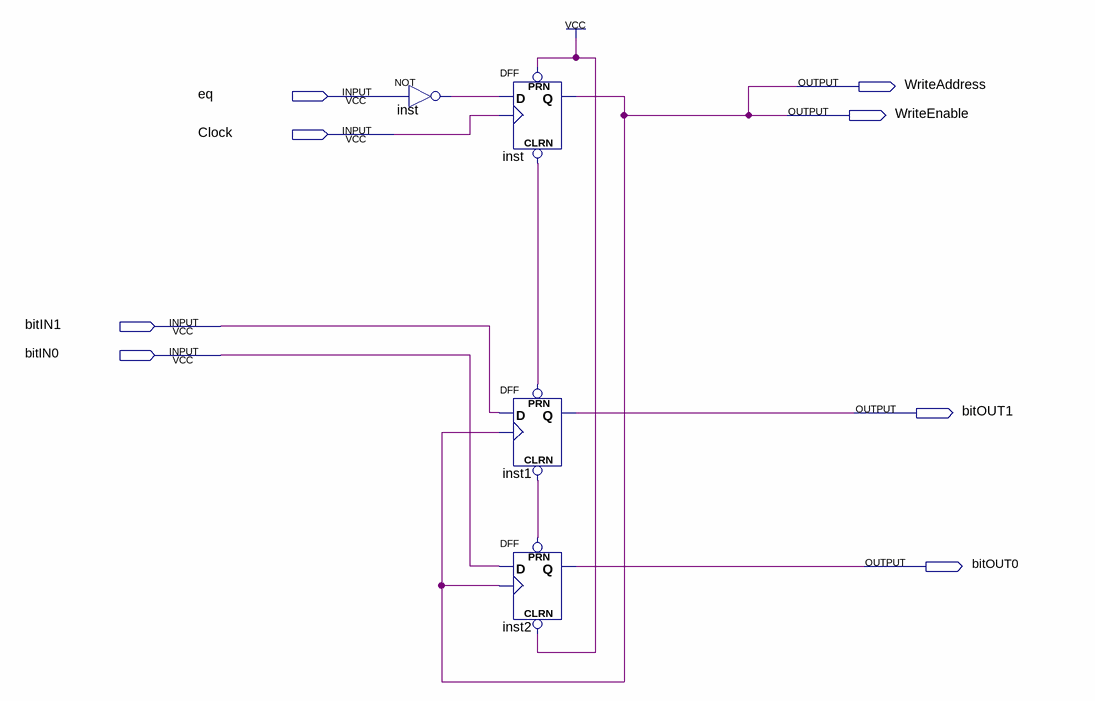
[diagram p0: schematic sheet]
// Quartus schematic fsm.bdf as structural Verilog: 4 symbols, 8 pins
module fsm (
  input  eq,
  input  Clock,
  input  bitIN1,
  input  bitIN0,
  output WriteAddress,
  output WriteEnable,
  output bitOUT1,
  output bitOUT0
);

  wire inst_out, undriven, undriven_2;

  not inst (inst_out, eq);
  DFF inst_dup2 (.CLRN(undriven), .CLK(Clock), .D(inst_out), .PRN(1'b1), .Q(WriteAddress));
  DFF inst1 (.CLRN(undriven_2), .CLK(WriteAddress), .D(bitIN1), .PRN(undriven), .Q(bitOUT1));
  DFF inst2 (.CLRN(1'b1), .CLK(WriteAddress), .D(bitIN0), .PRN(undriven_2), .Q(bitOUT0));

  assign WriteEnable = WriteAddress;
endmodule
